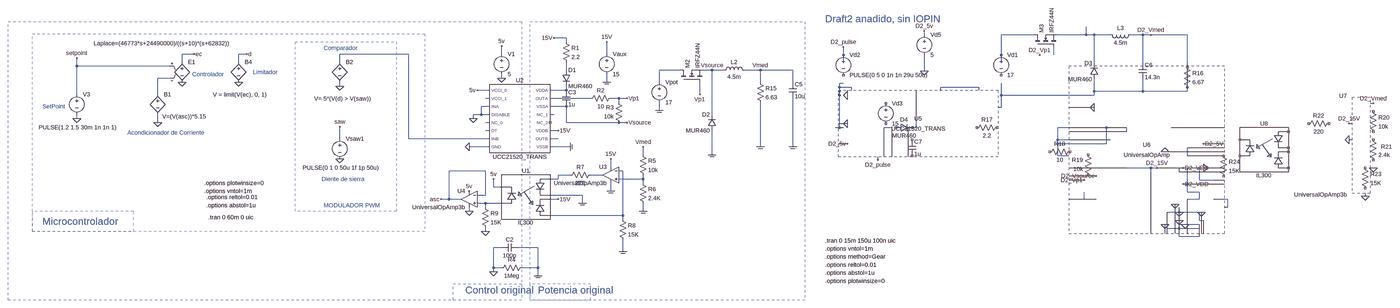
[diagram p0: schematic buckbooxt_con_Draft2.asc, whole sheet]
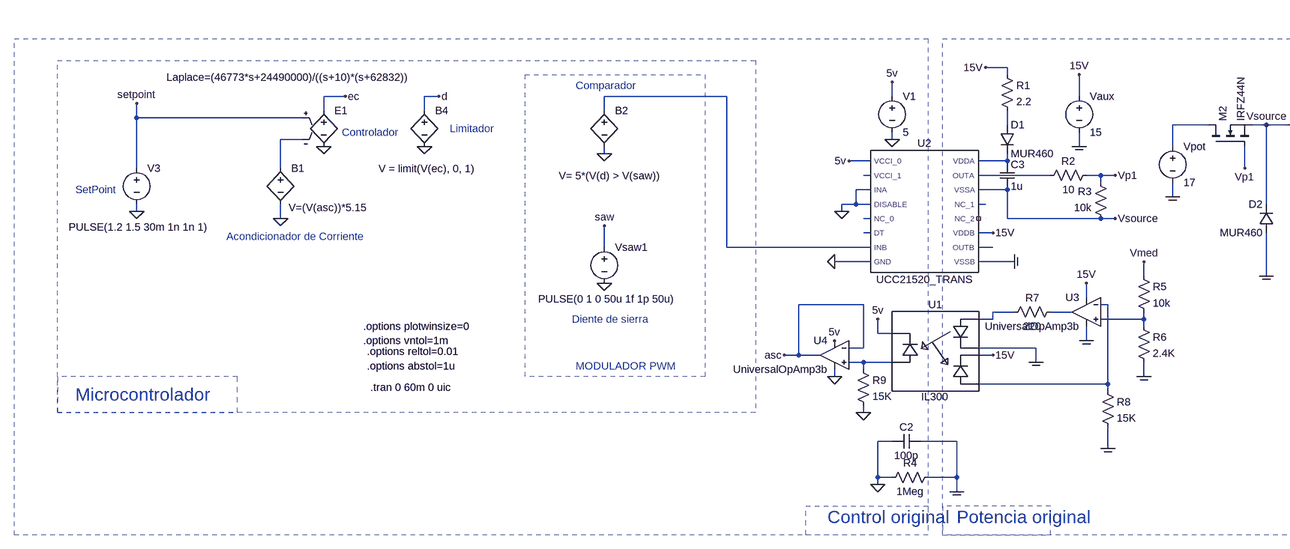
[diagram p1: schematic buckbooxt_con_Draft2.asc, part, row 1 of 1, column 1 of 2]
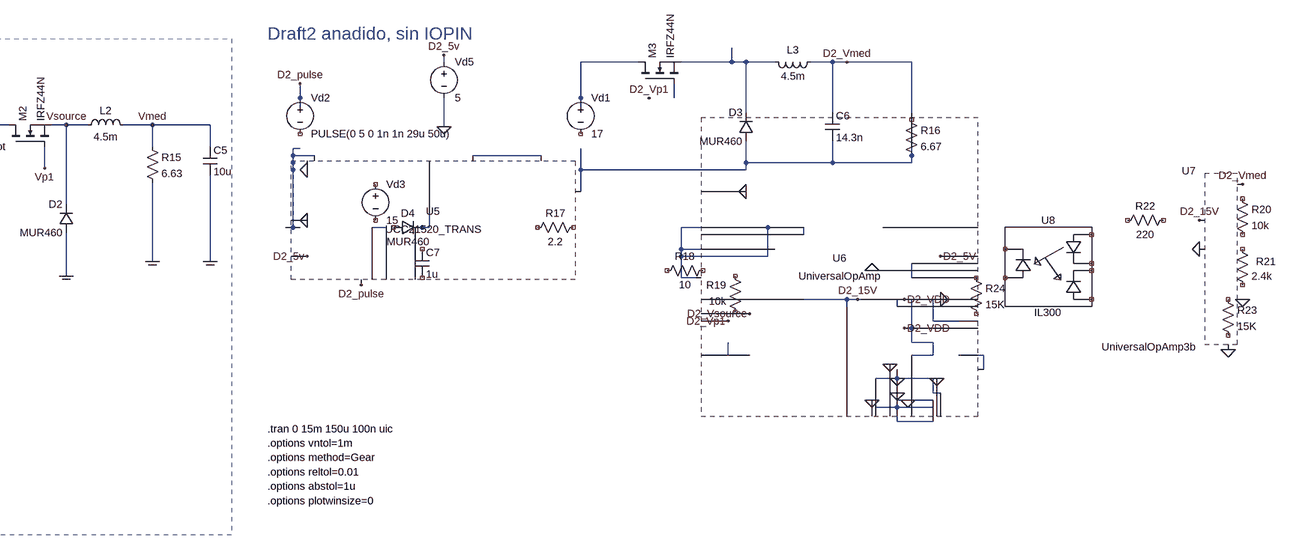
[diagram p2: schematic buckbooxt_con_Draft2.asc, part, row 1 of 1, column 2 of 2]
buckbooxt_con_Draft2.asc, the LTspice schematic file:
Version 4.1
SHEET 1 5200 1900
WIRE 1024 480 976 480
WIRE 1024 496 1024 480
WIRE -448 544 -496 544
WIRE -240 544 -272 544
WIRE 400 544 128 544
WIRE 768 544 768 512
WIRE 1184 544 1184 496
WIRE -496 576 -496 544
WIRE -272 576 -272 544
WIRE 128 576 128 544
WIRE -912 592 -912 560
WIRE -544 592 -912 592
WIRE 1024 608 1024 576
WIRE 1472 608 1392 608
WIRE 1600 608 1568 608
WIRE 1648 608 1600 608
WIRE 1792 608 1728 608
WIRE 1920 608 1792 608
WIRE -544 640 -592 640
WIRE 768 640 768 624
WIRE 1184 656 1184 624
WIRE 1392 656 1392 608
WIRE 1792 656 1792 608
WIRE 1920 656 1920 608
WIRE 128 672 128 656
WIRE 720 688 672 688
WIRE 1024 688 1024 672
WIRE 1024 688 960 688
WIRE -912 704 -912 592
WIRE -592 704 -592 640
WIRE 1552 704 1552 656
WIRE 720 720 704 720
WIRE 1120 720 960 720
WIRE 1232 720 1200 720
WIRE 1264 720 1232 720
WIRE 1232 736 1232 720
WIRE 720 752 688 752
WIRE 1024 752 960 752
WIRE 1392 768 1392 736
WIRE 688 784 688 752
WIRE 688 784 656 784
WIRE 720 784 688 784
WIRE 976 784 960 784
WIRE 1600 784 1600 608
WIRE -912 800 -912 784
WIRE 656 800 656 784
WIRE -592 816 -592 784
WIRE 720 816 704 816
WIRE 976 816 976 816
WIRE 1024 816 1024 752
WIRE 1232 816 1024 816
WIRE 1264 816 1232 816
WIRE 720 848 704 848
WIRE 992 848 960 848
WIRE 128 880 128 832
WIRE 400 880 400 544
WIRE 720 880 400 880
WIRE 992 880 960 880
WIRE 720 912 640 912
WIRE 1040 912 960 912
WIRE 1792 912 1792 736
WIRE 1920 912 1920 720
WIRE 1328 944 1328 912
WIRE 1600 944 1600 848
WIRE 1200 992 1200 960
WIRE 704 1008 560 1008
WIRE 1248 1008 1232 1008
WIRE 1040 1024 992 1024
WIRE 1168 1024 1120 1024
WIRE 992 1040 992 1024
WIRE 992 1040 960 1040
WIRE 1328 1040 1328 1024
WIRE 1328 1040 1232 1040
WIRE 1328 1056 1328 1040
WIRE 736 1072 736 1040
WIRE 768 1072 736 1072
WIRE 1200 1088 1200 1056
WIRE 704 1104 704 1008
WIRE 704 1104 672 1104
WIRE 1088 1104 960 1104
WIRE 560 1120 560 1008
WIRE 560 1120 528 1120
WIRE 608 1120 560 1120
WIRE 992 1120 960 1120
WIRE 704 1136 672 1136
WIRE 768 1136 704 1136
WIRE 1088 1136 1088 1104
WIRE 704 1152 704 1136
WIRE 640 1168 640 1152
WIRE 1328 1168 1328 1136
WIRE 1248 1184 1248 1008
WIRE 1248 1184 960 1184
WIRE 1248 1200 1248 1184
WIRE 704 1248 704 1232
WIRE 768 1312 736 1312
WIRE 912 1312 832 1312
WIRE 1248 1328 1248 1280
WIRE 736 1392 736 1312
WIRE 768 1392 736 1392
WIRE 912 1392 912 1312
WIRE 912 1392 848 1392
WIRE 736 1408 736 1392
WIRE 912 1424 912 1392
FLAG 768 640 0
FLAG 768 512 5v
FLAG 1184 496 15V
FLAG 1184 656 COM
FLAG 736 1408 0
FLAG 672 688 5v
FLAG 976 480 15V
FLAG 1040 912 COM
FLAG 1600 944 COM
FLAG 1792 912 COM
FLAG 1920 912 COM
FLAG 1392 768 COM
FLAG 640 912 0
FLAG 992 848 15V
FLAG 656 800 0
FLAG 736 1040 5v
FLAG 528 1120 asc
FLAG 128 960 0
FLAG 128 832 saw
FLAG -592 816 0
FLAG -912 800 0
FLAG -496 656 0
FLAG -240 544 d
FLAG -272 656 0
FLAG -448 544 ec
FLAG 128 672 0
FLAG 912 1424 COM
FLAG -912 560 setpoint
FLAG 1792 608 Vmed
FLAG 1552 704 Vp1
FLAG 1264 720 Vp1
FLAG 1600 608 Vsource
FLAG 1264 816 Vsource
FLAG 1328 912 Vmed
FLAG 992 1120 15V
FLAG 704 1248 0
FLAG 640 1088 5v
FLAG 640 1168 0
FLAG 1248 1328 COM
FLAG 1328 1168 COM
FLAG 1200 960 15V
FLAG 1200 1088 COM
FLAG 1088 1136 COM
SYMBOL voltage 768 528 R0
SYMATTR InstName V1
SYMATTR Value 5
SYMBOL voltage 1184 528 R0
WINDOW 123 0 0 Left 0
WINDOW 39 0 0 Left 0
SYMATTR InstName Vaux
SYMATTR Value 15
SYMBOL cap 832 1296 R90
WINDOW 0 0 32 VBottom 2
WINDOW 3 32 32 VTop 2
SYMATTR InstName C2
SYMATTR Value 100p
SYMBOL res 864 1376 R90
WINDOW 0 0 56 VBottom 2
WINDOW 3 32 56 VTop 2
SYMATTR InstName R4
SYMATTR Value 1Meg
SYMBOL nmos 1472 656 R270
SYMATTR InstName M2
SYMATTR Value IRFZ44N
SYMBOL ind 1632 624 R270
WINDOW 0 32 56 VTop 2
WINDOW 3 5 56 VBottom 2
SYMATTR InstName L2
SYMATTR Value 4.5m
SYMATTR SpiceLine Rser=1m
SYMBOL voltage 1392 640 R0
SYMATTR InstName Vpot
SYMATTR Value 17
SYMBOL diode 1616 848 R180
WINDOW 0 24 64 Left 2
WINDOW 3 24 0 Left 2
SYMATTR InstName D2
SYMATTR Value MUR460
SYMBOL res 1776 640 R0
SYMATTR InstName R15
SYMATTR Value 6.63
SYMBOL cap 1904 656 R0
SYMATTR InstName C5
SYMATTR Value 10u
SYMBOL bv -592 688 R0
WINDOW 3 18 104 Left 2
SYMATTR Value V=(V(asc))*5.15
SYMATTR InstName B1
SYMBOL voltage 128 864 R0
WINDOW 3 -147 131 Left 2
WINDOW 123 0 0 Left 0
WINDOW 39 0 0 Left 0
SYMATTR Value PULSE(0 1 0 50u 1f 1p 50u)
SYMATTR InstName Vsaw1
SYMBOL bv 128 560 R0
WINDOW 3 -101 161 Left 2
SYMATTR Value V= 5*(V(d) > V(saw))
SYMATTR InstName B2
SYMBOL voltage -912 688 R0
WINDOW 3 -151 147 Left 2
WINDOW 123 24 124 Left 0
WINDOW 39 0 0 Left 0
SYMATTR Value PULSE(1.2 1.5 30m 1n 1n 1)
SYMATTR InstName V3
SYMBOL e -496 560 R0
WINDOW 3 -350 -58 Left 2
SYMATTR Value Laplace=(46773*s+24490000)/((s+10)*(s+62832))
SYMATTR InstName E1
SYMBOL bv -272 560 R0
WINDOW 3 -102 145 Left 2
SYMATTR Value V = limit(V(ec), 0, 1)
SYMATTR InstName B4
SYMBOL UCC21520_TRANS 832 800 R0
SYMATTR InstName U2
SYMBOL res 1008 480 R0
SYMATTR InstName R1
SYMATTR Value 2.2
SYMBOL diode 1008 608 R0
SYMATTR InstName D1
SYMATTR Value MUR460
SYMBOL cap 1008 688 R0
SYMATTR InstName C3
SYMATTR Value 1u
SYMBOL res 1216 704 R90
WINDOW 0 0 56 VBottom 2
WINDOW 3 32 56 VTop 2
SYMATTR InstName R2
SYMATTR Value 10
SYMBOL res 1248 832 R180
WINDOW 0 36 76 Left 2
WINDOW 3 36 40 Left 2
SYMATTR InstName R3
SYMATTR Value 10k
SYMBOL IL300 864 1104 M0
SYMATTR InstName U1
SYMBOL res 1312 928 R0
SYMATTR InstName R5
SYMATTR Value 10k
SYMBOL res 1312 1040 R0
SYMATTR InstName R6
SYMATTR Value 2.4K
SYMBOL OpAmps\UniversalOpAmp3b 1200 1024 M0
SYMATTR InstName U3
SYMBOL res 1136 1008 R90
WINDOW 0 0 56 VBottom 2
WINDOW 3 32 56 VTop 2
SYMATTR InstName R7
SYMATTR Value 220
SYMBOL res 1232 1184 R0
SYMATTR InstName R8
SYMATTR Value 15K
SYMBOL OpAmps\UniversalOpAmp3b 640 1120 M0
SYMATTR InstName U4
SYMBOL res 688 1136 R0
SYMATTR InstName R9
SYMATTR Value 15K
TEXT -392 1192 Left 2 !.tran 0 60m 0 uic
TEXT -400 1112 Left 2 !.options reltol=0.01
TEXT -400 1144 Left 2 !.options abstol=1u
TEXT -408 1088 Left 2 !.options vntol=1m
TEXT -408 1056 Left 2 !.options plotwinsize=0
TEXT 64 520 Left 2 ;Comparador
TEXT 56 1040 Left 2 ;Diente de sierra
TEXT -712 856 Left 2 ;Acondicionador de Corriente
TEXT -456 624 Left 2 ;Controlador
TEXT -216 616 Left 2 ;Limitador
TEXT 64 1144 Left 2 ;MODULADOR PWM
TEXT -1048 1208 Left 4 ;Microcontrolador
TEXT -1048 752 Left 2 ;SetPoint
TEXT 912 1480 Left 4 ;Potencia original
TEXT 624 1480 Left 4 ;Control original
RECTANGLE Normal 464 1248 -1088 464 2
RECTANGLE Normal -688 1168 -1088 1248 2
RECTANGLE Normal 848 1520 -1184 416 2
RECTANGLE Normal 1968 1520 880 416 2
RECTANGLE Normal 576 1456 848 1520 2
RECTANGLE Normal 1120 1456 880 1520 2
RECTANGLE Normal 352 1168 -48 496 2
WIRE 2440 468 2440 452
WIRE 2872 468 2744 468
WIRE 3080 468 3080 436
WIRE 3080 468 2968 468
WIRE 3112 468 3080 468
WIRE 3176 468 3112 468
WIRE 3304 468 3256 468
WIRE 3336 468 3304 468
WIRE 3480 468 3336 468
WIRE 2952 548 2952 516
WIRE 2120 580 2120 516
WIRE 2744 580 2744 468
WIRE 3112 580 3112 468
WIRE 3304 580 3304 468
WIRE 3480 580 3480 468
WIRE 2440 612 2440 548
WIRE 2120 660 2104 660
WIRE 2152 676 2104 676
WIRE 2656 676 2504 676
WIRE 2104 692 2104 660
WIRE 2104 692 2104 676
WIRE 3112 692 3112 644
WIRE 3304 692 3304 644
WIRE 3304 692 3112 692
WIRE 3480 692 3480 660
WIRE 3480 692 3304 692
WIRE 2104 708 2104 692
WIRE 2744 708 2744 660
WIRE 3112 708 3112 692
WIRE 3112 708 2744 708
WIRE 2744 756 2744 708
WIRE 2104 836 2104 676
WIRE 2104 836 2088 836
WIRE 2120 836 2104 836
WIRE 2312 836 2280 836
WIRE 2408 836 2408 804
WIRE 2408 836 2376 836
WIRE 3176 836 2968 836
WIRE 3448 836 3416 836
WIRE 3240 852 3240 836
WIRE 3176 884 2968 884
WIRE 3160 900 3160 836
WIRE 3160 900 2968 900
WIRE 2968 948 2968 836
WIRE 3000 948 2968 948
WIRE 3480 948 3480 916
WIRE 3368 996 3240 996
WIRE 3448 996 3400 996
WIRE 3528 996 3480 996
WIRE 3336 1012 3336 996
WIRE 3448 1012 3448 996
WIRE 3528 1012 3528 996
WIRE 3528 1044 3528 1012
WIRE 3584 1044 3528 1044
WIRE 3480 1060 3480 996
WIRE 3528 1060 3480 1060
WIRE 3480 1092 3480 1060
WIRE 3528 1092 3480 1092
WIRE 3072 1120 3072 1092
WIRE 3120 1120 3072 1120
WIRE 3528 1120 3528 1092
WIRE 3528 1120 3480 1120
WIRE 3640 1120 3584 1120
WIRE 3640 1152 3640 1120
WIRE 3448 1172 3448 1152
WIRE 3448 1172 3400 1172
WIRE 3528 1172 3448 1172
WIRE 3528 1188 3528 1172
WIRE 3448 1204 3448 1172
WIRE 3528 1204 3528 1188
WIRE 3544 1204 3528 1204
WIRE 3448 1220 3448 1204
WIRE 3528 1220 3448 1220
WIRE 3400 1236 3400 1204
WIRE 3448 1236 3400 1236
WIRE 3528 1236 3448 1236
WIRE 3528 1252 3528 1236
WIRE 3448 1268 3448 1236
WIRE 3528 1268 3448 1268
FLAG 3112 756 0
FLAG 2136 708 0
FLAG 2120 516 D2_pulse
FLAG 2256 964 D2_pulse
FLAG 2136 900 D2_5v
FLAG 2440 452 D2_5v
FLAG 2896 548 D2_Vp1
FLAG 2136 820 0
FLAG 3432 1140 0
FLAG 3464 1060 D2_VDD
FLAG 3464 996 D2_VDD
FLAG 3072 1044 D2_Vp1
FLAG 3120 1028 D2_Vsource
FLAG 3336 468 D2_Vmed
FLAG 4216 740 D2_Vmed
FLAG 3360 996 D2_15V
FLAG 4216 996 0
FLAG 4184 1108 0
FLAG 4120 820 D2_15V
FLAG 3544 900 D2_5V
FLAG 3544 996 0
FLAG 4120 884 0
FLAG 3392 932 0
FLAG 2440 612 0
FLAG 3392 1220 0
FLAG 3536 1172 0
FLAG 3472 1220 0
FLAG 3448 1172 0
FLAG 3448 1204 0
SYMBOL voltage 2744 532 R0
WINDOW 123 0 0 Left 0
WINDOW 39 0 0 Left 0
SYMATTR InstName Vd1
SYMATTR Value 17
SYMBOL voltage 2120 532 R0
WINDOW 123 0 0 Left 0
WINDOW 39 0 0 Left 0
SYMATTR InstName Vd2
SYMATTR Value PULSE(0 5 0 1n 1n 29u 50u)
SYMBOL diode 3128 644 R180
WINDOW 0 24 64 Left 2
WINDOW 3 24 0 Left 2
SYMATTR InstName D3
SYMATTR Value MUR460
SYMBOL cap 3288 580 R0
SYMATTR InstName C6
SYMATTR Value 14.3n
SYMBOL ind 3272 452 R90
WINDOW 0 5 56 VBottom 2
WINDOW 3 32 56 VTop 2
SYMATTR InstName L3
SYMATTR Value 4.5m
SYMATTR SpiceLine Rser=1m
SYMBOL res 3464 580 R0
SYMATTR InstName R16
SYMATTR Value 6.67
SYMBOL UCC21520_TRANS 2432 1012 R0
SYMATTR InstName U5
SYMBOL res 2744 820 R90
WINDOW 0 0 56 VBottom 2
WINDOW 3 32 56 VTop 2
SYMATTR InstName R17
SYMATTR Value 2.2
SYMBOL res 3032 916 R90
WINDOW 0 0 56 VBottom 2
WINDOW 3 32 56 VTop 2
SYMATTR InstName R18
SYMATTR Value 10
SYMBOL res 3104 1040 R180
WINDOW 0 36 76 Left 2
WINDOW 3 36 40 Left 2
SYMATTR InstName R19
SYMATTR Value 10k
SYMBOL voltage 2440 452 R0
WINDOW 123 0 0 Left 0
WINDOW 39 0 0 Left 0
SYMATTR InstName Vd5
SYMATTR Value 5
SYMBOL nmos 2872 516 R270
SYMATTR InstName M3
SYMATTR Value IRFZ44N
SYMBOL diode 2328 852 R270
WINDOW 0 32 32 VTop 2
WINDOW 3 0 32 VBottom 2
SYMATTR InstName D4
SYMATTR Value MUR460
SYMBOL voltage 2288 724 R0
WINDOW 123 0 0 Left 0
WINDOW 39 0 0 Left 0
SYMATTR InstName Vd3
SYMATTR Value 15
SYMBOL cap 2376 884 R0
SYMATTR InstName C7
SYMATTR Value 1u
SYMBOL res 4200 756 R0
SYMATTR InstName R20
SYMATTR Value 10k
SYMBOL res 4200 868 R0
WINDOW 0 46 44 Left 2
SYMATTR InstName R21
SYMATTR Value 2.4k
SYMBOL res 4056 804 R90
WINDOW 0 0 56 VBottom 2
WINDOW 3 32 56 VTop 2
SYMATTR InstName R22
SYMATTR Value 220
SYMBOL res 4168 980 R0
SYMATTR InstName R23
SYMATTR Value 15K
SYMBOL lib\sym\OpAmps\UniversalOpAmp 3544 916 M0
SYMATTR InstName U6
SYMBOL res 3608 932 R0
SYMATTR InstName R24
SYMATTR Value 15K
SYMBOL OpAmps\UniversalOpAmp3b 4120 852 M0
SYMATTR InstName U7
SYMBOL IL300 3784 916 M0
SYMATTR InstName U8
TEXT 2048 404 Left 4 ;Draft2 anadido, sin IOPIN
TEXT 2048 1284 Left 2 !.tran 0 15m 150u 100n uic
TEXT 2048 1316 Left 2 !.options vntol=1m
TEXT 2048 1348 Left 2 !.options method=Gear
TEXT 2048 1380 Left 2 !.options reltol=0.01
TEXT 2048 1412 Left 2 !.options abstol=1u
TEXT 2048 1444 Left 2 !.options plotwinsize=0

The netlist it stands for:
* buckbooxt_con_Draft2.asc
V1 5v 0 5
Vaux 15V COM 15
C2 COM 0 100p
R4 COM 0 1Meg
M2 N003 Vp1 Vsource Vsource IRFZ44N
L2 Vsource Vmed 4.5m Rser=1m
Vpot N003 COM 17
D2 COM Vsource MUR460
R15 Vmed COM 6.63
C5 Vmed COM 10u
B1 N004 0 V=(V(asc))*5.15
Vsaw1 saw 0 PULSE(0 1 0 50u 1f 1p 50u)
B2 N001 0 V= 5*(V(d) > V(saw))
V3 setpoint 0 PULSE(1.2 1.5 30m 1n 1n 1)
E1 ec 0 setpoint N004 Laplace=(46773*s+24490000)/((s+10)*(s+62832))
B4 d 0 V = limit(V(ec), 0, 1)
X§U2 0 N011 0 0 N001 N007 N012 5v N006 N005 15V Vsource COM N009 N008 NC_01 UCC21520_TRANS  ; pins DISABLE DT GND INA INB OUTA OUTB VCCI_0 VCCI_1 VDDA VDDB VSSA VSSB NC_0 NC_1 NC_2
R1 15V N002 2.2
D1 N002 N005 MUR460
C3 N005 Vsource 1u
R2 Vp1 N007 10
R3 Vsource Vp1 10k
X§U1 COM N014 15V N013 N017 5v IL300  ; pins LEDC LEDA PD1C PD1A PD2A PD2C
R5 Vmed N016 10k
R6 N016 COM 2.4K
* U3: UniversalOpAmp3b (symbol OpAmps\UniversalOpAmp3b not available, pins judged from their places): In+=N016 In-=N013 V+=15V V-=COM OUT=N015
R7 N015 N014 220
R8 N013 COM 15K
* U4: UniversalOpAmp3b (symbol OpAmps\UniversalOpAmp3b not available, pins judged from their places): In+=N017 In-=asc V+=5v V-=0 OUT=asc
R9 N017 0 15K
Vd1 N018 NC_02 17
Vd2 D2_pulse NC_03 PULSE(0 5 0 1n 1n 29u 50u)
D3 N023 N019 MUR460
C6 D2_Vmed N023 14.3n
L3 D2_Vmed N019 4.5m Rser=1m
R16 NC_04 N023 6.67
* U5: UCC21520_TRANS (symbol UCC21520_TRANS not available, pin order unknown); nets seen at it: 0, D2_5v, D2_pulse, N021, N022, N023, N024, N025
R17 NC_05 NC_06 2.2
R18 NC_07 NC_08 10
R19 NC_09 NC_10 10k
Vd5 D2_5v 0 5
M3 N018 N020 N019 N019 IRFZ44N
D4 NC_11 N025 MUR460
Vd3 NC_12 NC_13 15
C7 NC_14 NC_15 1u
R20 NC_16 NC_17 10k
R21 NC_18 NC_19 2.4k
R22 NC_20 NC_21 220
R23 NC_22 NC_23 15K
* U6: UniversalOpAmp (symbol lib\sym\OpAmps\UniversalOpAmp not available, pin order unknown); nets seen at it: 0, D2_15V, D2_5v, D2_VDD, D2_Vmed, D2_Vp1, D2_Vsource, N023, N026, N027, N028, N029, N030, N031, N032, N033, N034
R24 NC_24 NC_25 15K
* U7: UniversalOpAmp3b (symbol OpAmps\UniversalOpAmp3b not available, pin order unknown); nets seen at it: 0, D2_15V, D2_Vmed
X§U8 NC_26 NC_27 NC_28 NC_29 NC_30 NC_31 IL300  ; pins LEDC LEDA PD1C PD1A PD2A PD2C
.model D D
.lib standard.dio
.model NMOS NMOS
.model PMOS PMOS
.lib standard.mos
.tran 0 60m 0 uic
.options reltol=0.01
.options abstol=1u
.options vntol=1m
.options plotwinsize=0
* Comparador
* Diente de sierra
* Acondicionador de Corriente
* Controlador
* Limitador
* MODULADOR PWM
* Microcontrolador
* SetPoint
* Potencia original
* Control original
* Draft2 anadido, sin IOPIN
.tran 0 15m 150u 100n uic
.options vntol=1m
.options method=Gear
.options reltol=0.01
.options abstol=1u
.options plotwinsize=0
.lib UCC21520_TRANS.lib
.lib IL300.SUB
.backanno
.end